# EAGLE design Adapter-Power1 (EAGLE 5.06)
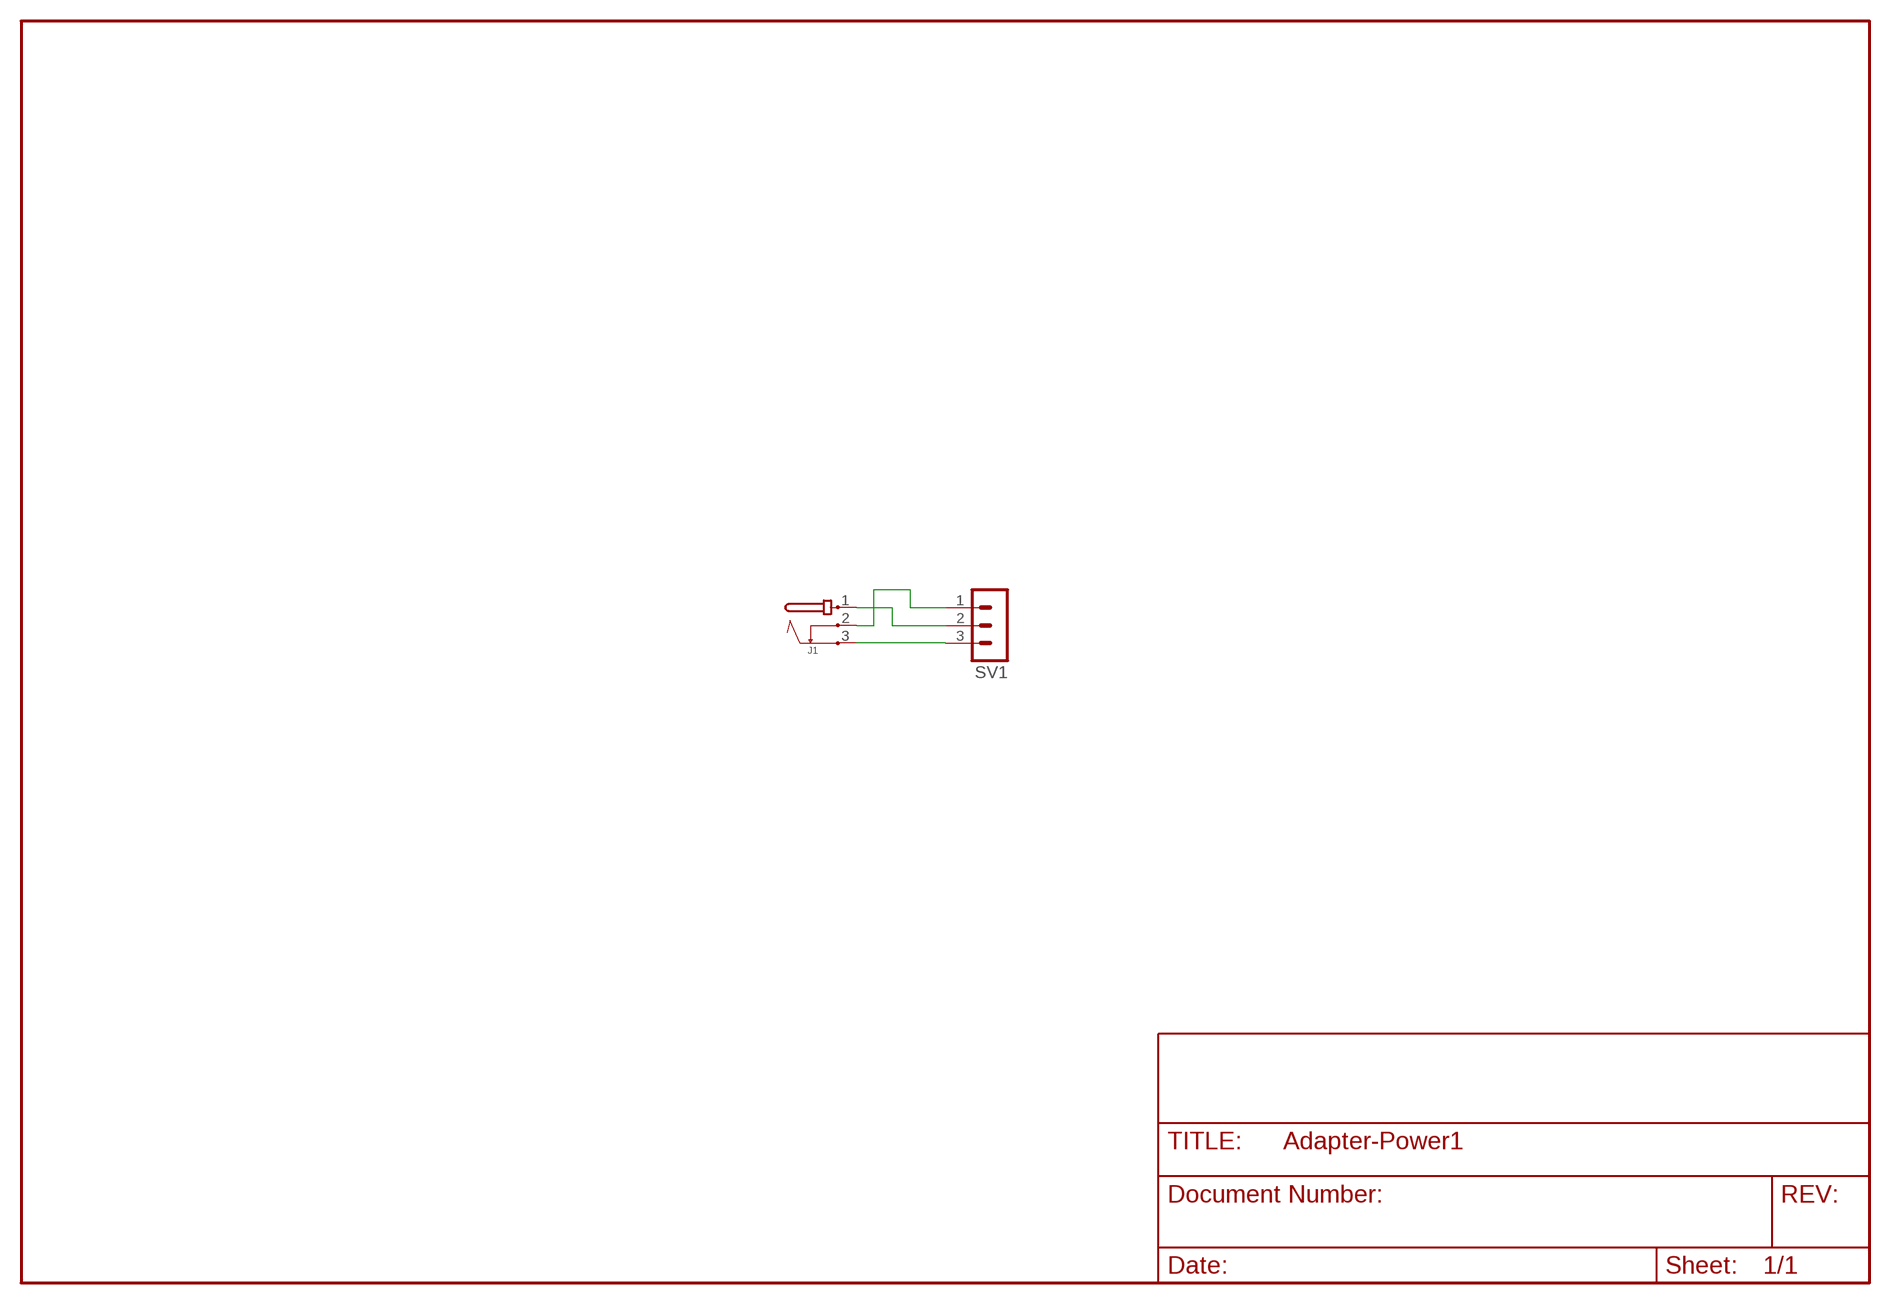
[diagram p0: schematic, sheet 1]

## Parts
J1  JACK-PMS  [JACK-PMS]
SV1  MA03-1  [MA03-1]

## Nets
N$1: J1.1 SV1.2
N$2: J1.2 SV1.1
N$3: J1.3 SV1.3

## Library data of the parts
J1 = POWER-IN:JACK-PMS
SV1 = con-lstb:MA03-1: PIN HEADER

## Net classes
0 default: width 2 mm

## Board
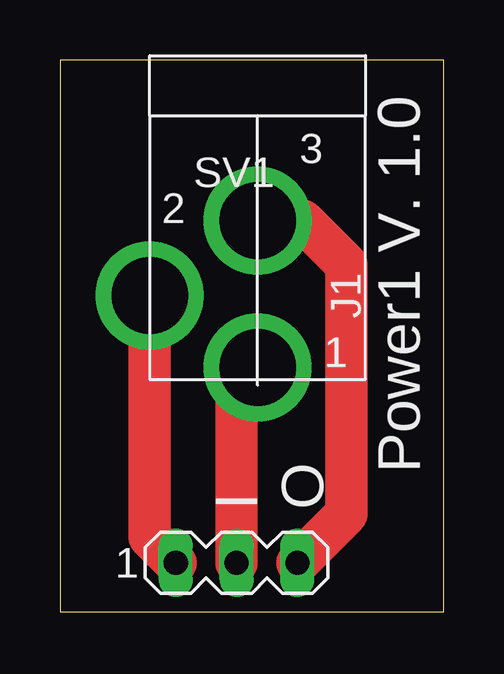
[diagram p1: board, top side]
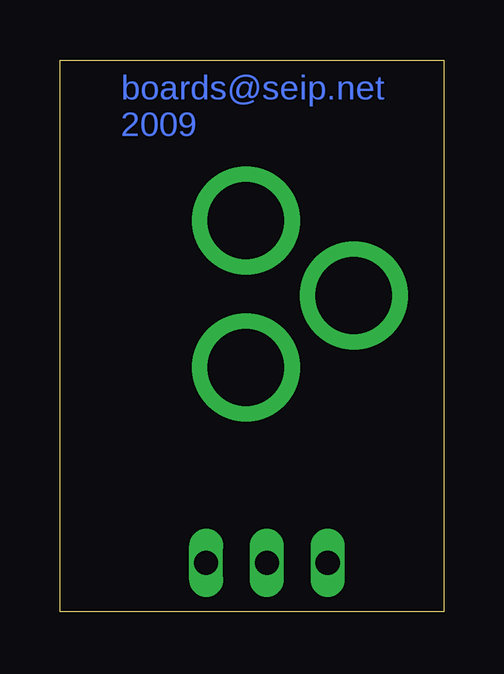
[diagram p2: board, bottom side, seen from below]

Size 16 x 23 mm. Coordinates in mm from the lower left corner, seen from the top.
Outline: 0,0 16,0 16,23 0,23 0,0
Copper layers (1*16): Top 0.035mm / dielectric 1.5mm / Bottom 0.035mm
Design rules "PCB-POOL": minimum track width 6mil, minimum drill 12mil, track to track 6mil, track to pad 6mil, pad to pad 6mil, via to via 6mil, smd to smd 6mil, copper to edge 20mil, drill to drill 8mil, minimum pad ring 8mil, minimum via ring 6mil, stop-mask expansion 3mil, vias tented up to drill 0mil, thermal gap 8mil

### Footprints (pad centres in the part's own frame; a part is rotated, then mirrored left to right if it is on the bottom)
JACK-PMS = drill 3.2 pad 4.5 round: 1 -0.5,-3.31; 2 -5,-0.31; 3 -0.5,2.809
MA03-1 = drill 1.016 long: 1 -2.54,0; 2 0,0; 3 2.54,0

### Placement (x,y rotation side)
J1  8.75,13.49 0 top
SV1  7.37,2.03 0 top

### Tracks (layer width: path | path; a pad name or v marks a point on that pad's centre or on a via)
N$1
  Top 1.778: J1.1 8.15,10.18 7.37,9.4 SV1.2
N$2
  Top 1.778: J1.2 3.75,3.11 SV1.1
N$3
  Top 1.778: J1.3 10.12,16.3 11.94,14.48 11.94,4.06 SV1.3

### Text on the board
Bottom: boards@seip.net | 2009
tNames: Power1 V. 1.0 | I | O